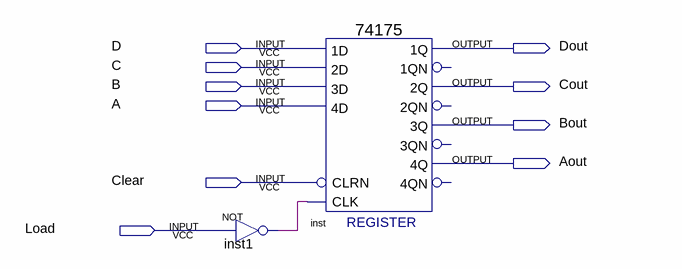
[diagram p0: schematic sheet]
// Quartus schematic RegisterPIPO75.bdf as structural Verilog: 2 symbols, 10 pins
module RegisterPIPO75 (
  input  D,
  input  C,
  input  B,
  input  A,
  input  Clear,
  input  Load,
  output Dout,
  output Cout,
  output Bout,
  output Aout
);

  wire inst1_out;

  not inst1 (inst1_out, Load);
  \74175  inst (
    .CLRN(Clear), .CLK(inst1_out), .\3D (B), .\2D (C), .\1D (D), .\4D (A), .\1Q (Dout), .\3Q (Bout),
    .\2Q (Cout), .\4Q (Aout));  // open: 1QN, 2QN, 4QN, 3QN
endmodule
